# Altium schematic sheet ORing Controller and FETs.SchDoc
size A; SheetNumber: 1; SheetTotal: 1
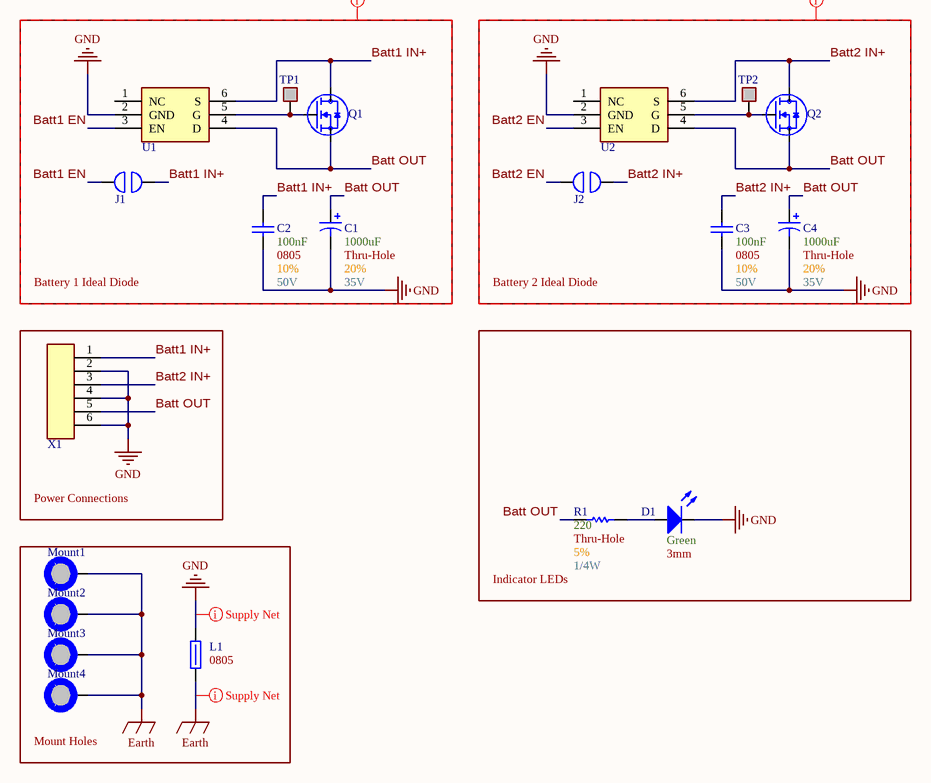
[diagram p0: ORing Controller and FETs.SchDoc]

## Parts
C1  Max Voltage: 35V  Size Package: Thru-Hole  Tolerance: 20%  Capacitance: 1000uF  [[Cap] Thru-Hole Polarized 10mm]  (hidden comment: [Cap] Thru-Hole 1000uF 20% 35V)
C2  Max Voltage: 50V  Size Package: 0805  Tolerance: 10%  Capacitance: 100nF  [[Cap] SMD 0805]  (hidden comment: [Cap] 0805 0.1uF 10% 50V)
C3  Max Voltage: 50V  Size Package: 0805  Tolerance: 10%  Capacitance: 100nF  [[Cap] SMD 0805]  (hidden comment: [Cap] 0805 0.1uF 10% 50V)
C4  Max Voltage: 35V  Size Package: Thru-Hole  Tolerance: 20%  Capacitance: 1000uF  [[Cap] Thru-Hole Polarized 10mm]  (hidden comment: [Cap] Thru-Hole 1000uF 20% 35V)
D1  Color: Green  Lens Diameter: 3mm  [[LED] Thru-Hole 3mm]  (hidden comment: [LED] Thru-Hole 3mm Green)
J1  [Jumper] Thru-Hole 2pin  [[Jumper] Thru-Hole 2pin]  (value not drawn)
J2  [Jumper] Thru-Hole 2pin  [[Jumper] Thru-Hole 2pin]  (value not drawn)
L1  Size Package: 0805  [[Ferrite] SMD 0805]  (hidden comment: 652-MH2029-300Y)
Mount1  M3 Mount Hole  [[Mount] M3 Mount Hole]  (value not drawn)  (no BOM)
Mount2  M3 Mount Hole  [[Mount] M3 Mount Hole]  (value not drawn)  (no BOM)
Mount3  M3 Mount Hole  [[Mount] M3 Mount Hole]  (value not drawn)  (no BOM)
Mount4  M3 Mount Hole  [[Mount] M3 Mount Hole]  (value not drawn)  (no BOM)
Q1  NMOS  [[NMOS] SMD 40V 509A]  (value not drawn)
Q2  NMOS  [[NMOS] SMD 40V 509A]  (value not drawn)
R1  Size Package: Thru-Hole  Wattage: 1/4W  Tolerance: 5%  Resistance: 220  [[Res] Thru-Hole 1/4W]  (hidden comment: [220] Thru-Hole 5% 1/4W)
TP1  [THM] Thru-Hole  [[THM] White]  (value not drawn)
TP2  [THM] Thru-Hole  [[THM] White]  (value not drawn)
U1  [ORing] NMOS Controller  [[ORing] NMOS Controller]  (value not drawn)
U2  [ORing] NMOS Controller  [[ORing] NMOS Controller]  (value not drawn)
X1  6pin Screw Terminal  [[Screw Terminal] 6pin 5mm]  (value not drawn)

## Blocks framed on the sheet
Battery 1 Ideal Diode: C1 C2 J1 Q1 TP1 U1
Battery 2 Ideal Diode: C3 C4 J2 Q2 TP2 U2
Power Connections: X1
Indicator LEDs: D1 R1
Mount Holes: L1 Mount1-Mount4

## Nets
Earth: L1.1 Mount1.1 Mount2.1 Mount3.1 Mount4.1
GND: C1.2 C2.2 C3.2 C4.2 D1.2(Cathode) L1.2 U1.2(GND) U2.2(GND) X1.2 X1.4 X1.6
Batt1 EN: J1.1 U1.3(EN)
Batt1 IN+: C2.1 J1.2 Q1.3(Drain) U1.6(S) X1.1
Batt2 EN: J2.1 U2.3(EN)
Batt2 IN+: C3.1 J2.2 Q2.3(Drain) U2.6(S) X1.3
Batt OUT: C1.1 C4.1 Q1.1(Source) Q2.1(Source) R1.1 U1.4(D) U2.4(D) X1.5
NetD1_1: D1.1(Anode) R1.2
NetQ1_2: Q1.2(Gate) TP1.1 U1.5(G)
NetQ2_2: Q2.2(Gate) TP2.1 U2.5(G)

Not connected (* = marked no-connect by the designer): U1 1(NC); U2 1(NC)

## Layout directives
net class Supply_Nets: Batt1 EN, Batt1 IN+, Batt2 EN, Batt2 IN+, Batt OUT, Earth, GND

## Library data of the parts
C1 C4 = [Cap] Thru-Hole 1000uF 20% 35V: 35PK1000MEFC10X20; Supplier 1: DigiKey; Supplier Part Number 1: 399-9886-1-ND
C2 C3 = [Cap] 0805 0.1uF 10% 50V: CL21B104KBCNNNC; Supplier 1: DigiKey; Supplier Part Number 1: 1276-1003-6-ND
D1 = [LED] Thru-Hole 3mm Green: 151031VS06000; Supplier 1: DigiKey; Supplier Part Number 1: 732-5008-ND
L1 = [Ferrite] SMD 0805 3A 30ohm: Res @ Freq: 30 @ 100MHz; Supplier 1: DigiKey; Supplier Part Number 1: MH2029-300YCT-ND
Mount1-Mount4 = [Mount] M3 Mount Hole: Place at least 4.5mm from board edge. Plated.
Q1 Q2 = [NMOS] SMD 40V 509A: NTMFS0D4N04XMT1G; Supplier 1: DigiKey; Supplier Part Number 1: 488-NTMFS0D4N04XMT1GCT-ND
R1 = [220] Thru-Hole 5% 1/4W: CFR-25JR-52-220R; Supplier 1: DigiKey; Supplier Part Number 1: 13-CFR-25JR-52-220RCT-ND
TP1 TP2 = [THM] Thru-Hole: 5012; Supplier 1: DigiKey; Supplier Part Number 1: 36-5012-ND
U1 U2 = [ORing] NMOS Controller: NCV68061SNAIT1G; Supplier 1: DigiKey; Supplier Part Number 1: 488-NCV68061SNAIT1GCT-ND
X1 = [Screw Terminal] 6pin: TB002-500-06BE; Supplier 1: DigiKey; Supplier Part Number 1: 102-6149-ND